# Altium project Brelok_MFU.PrjPcb
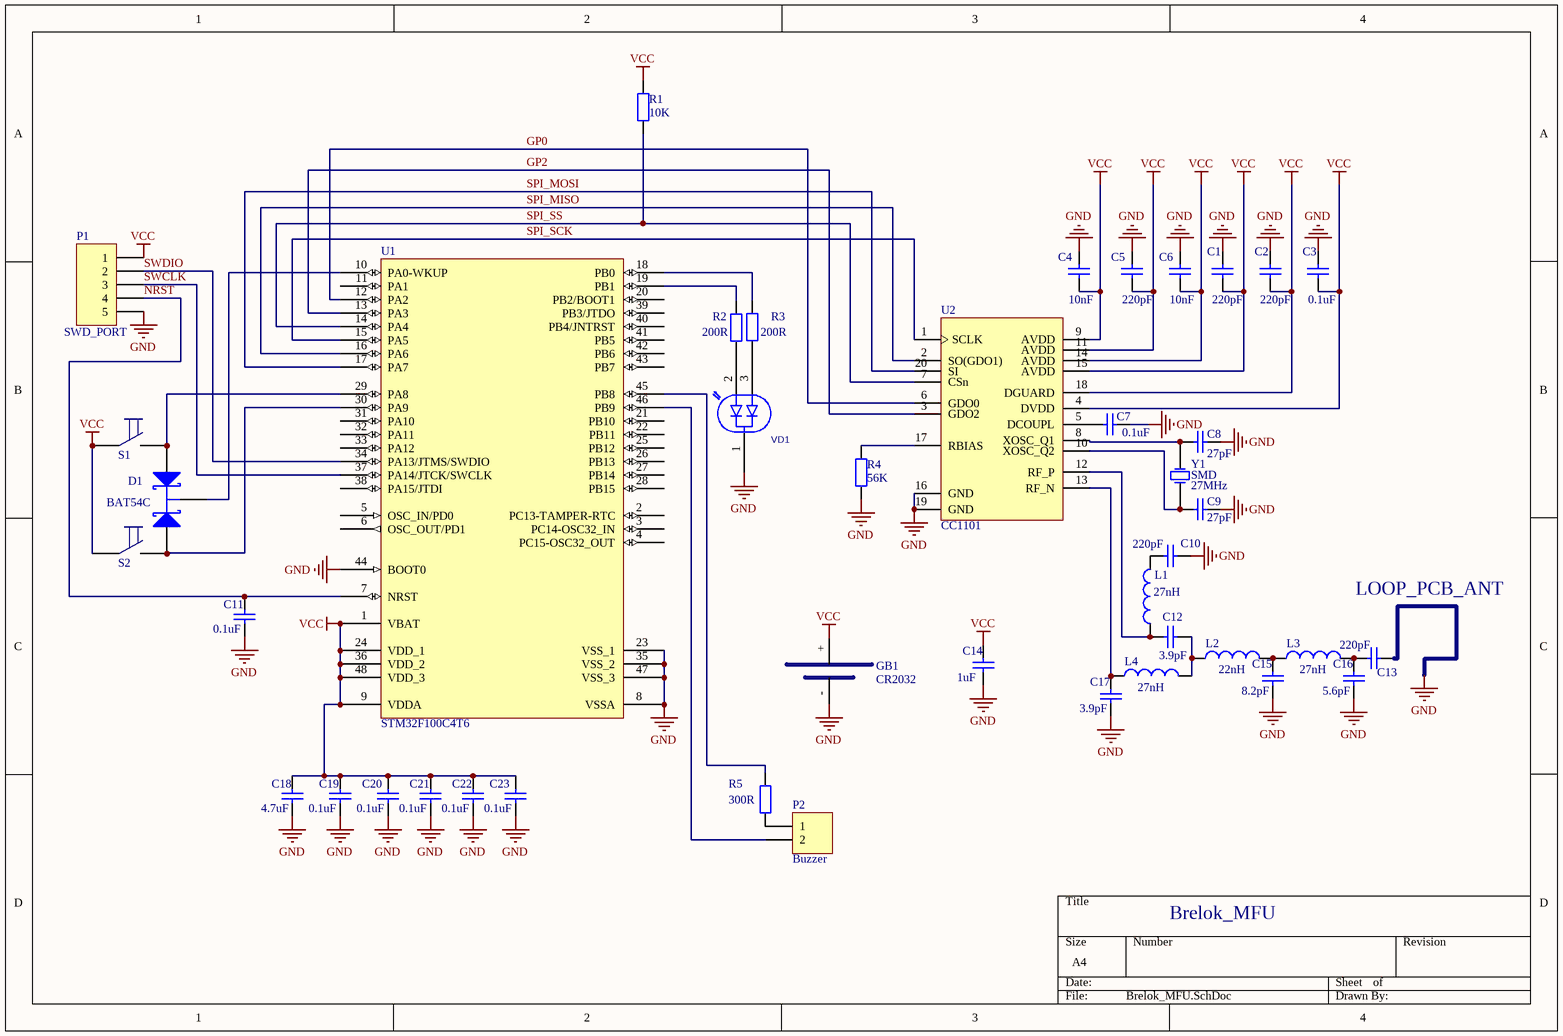
[diagram p0: Brelok_MFU.SchDoc]
1 sheet, 42 parts. Net scope: global (net labels, ports and power ports of the same name join across sheets).
Board file: Brelok_MFU.PcbDoc

## Sheet Brelok_MFU.SchDoc
size A4; Author: Gordeychik Alexandr; CompanyName: NTS; CurrentDate: 20.06.2013

### Parts
C1  value 220pF  [C0603]  (hidden comment: 0805)
C2  value 220pF  [C0603]  (hidden comment: 0805)
C3  value 0.1uF  [C0603]  (hidden comment: 0805)
C4  value 10nF  [C0603]  (hidden comment: 0805)
C5  value 220pF  [C0603]  (hidden comment: 0805)
C6  value 10nF  [C0603]  (hidden comment: 0805)
C7  value 0.1uF  [C0603]  (hidden comment: 0805)
C8  value 27pF  [C0603]  (hidden comment: 0805)
C9  value 27pF  [C0603]  (hidden comment: 0805)
C10  value 220pF  [C0603]  (hidden comment: 0805)
C11  value 0.1uF  [C0603]  (hidden comment: 0805)
C12  value 3.9pF  [C0603]  (hidden comment: 0805)
C13  value 220pF  [C0603]  (hidden comment: 0805)
C14  value 1uF  [C0603]  (hidden comment: 0805)
C15  value 8.2pF  [C0603]  (hidden comment: 0805)
C16  value 5.6pF  [C0603]  (hidden comment: 0805)
C17  value 3.9pF  [C0603]  (hidden comment: 0805)
C18  value 4.7uF  [C0805]  (hidden comment: 0805)
C19  value 0.1uF  [C0603]  (hidden comment: 0805)
C20  value 0.1uF  [C0603]  (hidden comment: 0805)
C21  value 0.1uF  [C0603]  (hidden comment: 0805)
C22  value 0.1uF  [C0603]  (hidden comment: 0805)
C23  value 0.1uF  [C0603]  (hidden comment: 0805)
D1  BAT54C  [SOT23_N]
GB1  CR2032  [BAT_Holder_CR2032]
L1  value 27nH  [L0603]  (hidden comment: SMD)
L2  value 22nH  [L0603]  (hidden comment: SMD)
L3  value 27nH  [L0603]  (hidden comment: SMD)
L4  value 27nH  [L0603]  (hidden comment: SMD)
P1  SWD_PORT  [HDR1X5]
P2  Buzzer  [HDR1X2]
R1  value 10K  [C0603]  (hidden comment: RES)
R2  value 200R  [C0603]  (hidden comment: RES)
R3  value 200R  [C0603]  (hidden comment: RES)
R4  value 56K  [C0603]  (hidden comment: RES)
R5  value 300R  [C0603]  (hidden comment: RES)
S1  KAN0642-0501B  [KAN0642-0501B]  (value not drawn)
S2  KAN0642-0501B  [KAN0642-0501B]  (value not drawn)
U1  STM32F100C4T6  [LQFP48_M]
U2  CC1101  [VQFN20]
VD1  LIGHTDIODE2  [LIGHTDIODE2]  (value not drawn)
Y1  SMD  [Quartz_SMD0603]

### Nets
GND: C1.1 C2.1 C3.1 C4.1 C5.1 C6.1 C7.2 C8.2 C9.2 C10.2 C11.2 C13.2 C14.2 C15.1 C16.1 C17.1 C18.2 C19.2 C20.2 C21.2 C22.2 C23.2 GB1.- P1.5 R4.1 U1.8(VSSA) U1.23(VSS_1) U1.35(VSS_2) U1.44(BOOT0) U1.47(VSS_3) U2.16(GND) U2.19(GND) VD1.1
VCC: C1.2 C2.2 C3.2 C4.2 C5.2 C6.2 C14.1 C18.1 C19.1 C20.1 C21.1 C22.1 C23.1 GB1.+ P1.1 R1.2 S1.1 S2.1 U1.1(VBAT) U1.9(VDDA) U1.24(VDD_1) U1.36(VDD_2) U1.48(VDD_3) U2.4(DVDD) U2.9(AVDD) U2.11(AVDD) U2.14(AVDD) U2.15(AVDD) U2.18(DGUARD)
GP0: U1.12(PA2) U2.6(GDO0)
GP2: U1.13(PA3) U2.3(GDO2)
NRST: C11.1 P1.4 U1.7(NRST)
SPI_MISO: U1.16(PA6) U2.2(SO(GDO1))
SPI_MOSI: U1.17(PA7) U2.20(SI)
SPI_SCK: U1.15(PA5) U2.1(SCLK)
SPI_SS: R1.1 U1.14(PA4) U2.7(CSn)
SWCLK: P1.3 U1.37(PA14/JTCK/SWCLK)
SWDIO: P1.2 U1.34(PA13/JTMS/SWDIO)
NetC7_1: C7.1 U2.5(DCOUPL)
NetC8_1: C8.1 U2.8(XOSC_Q1) Y1.1(OSC1)
NetC9_1: C9.1 U2.10(XOSC_Q2) Y1.3(OSC2)
NetC10_1: C10.1 L1.2
NetC12_1: C12.1 L2.1 L4.2
NetC12_2: C12.2 L1.1 U2.12(RF_P)
NetC13_1: C13.1 C16.2 L3.2
NetC15_2: C15.2 L2.2 L3.1
NetC17_2: C17.2 L4.1 U2.13(RF_N)
NetD1_1: D1.1(A1) S1.2 U1.29(PA8)
NetD1_2: D1.2(A2) S2.2 U1.30(PA9)
NetD1_3: D1.3(K) U1.10(PA0-WKUP)
NetP2_1: P2.1 R5.1
NetP2_2: P2.2 U1.46(PB9)
NetR2_1: R2.1 VD1.2
NetR2_2: R2.2 U1.19(PB1)
NetR3_1: R3.1 VD1.3
NetR3_2: R3.2 U1.18(PB0)
NetR4_2: R4.2 U2.17(RBIAS)
NetR5_2: R5.2 U1.45(PB8)

Not connected (* = marked no-connect by the designer): U1 2(PC13-TAMPER-RTC) 3(PC14-OSC32_IN) 4(PC15-OSC32_OUT) 5(OSC_IN/PD0) 6(OSC_OUT/PD1) 11(PA1) 20(PB2/BOOT1) 21(PB10) 22(PB11) 25(PB12) 26(PB13) 27(PB14) 28(PB15) 31(PA10) 32(PA11) 33(PA12) 38(PA15/JTDI) 39(PB3/JTDO) 40(PB4/JNTRST) 41(PB5) 42(PB6) 43(PB7)

### Notes on the sheet
- LOOP_PCB_ANT
- Brelok_MFU
- (in symbol Quartz_SMD) 27MHz

### Library data of the parts
C1-C23 = Capasitor_SMD_0805: Capasitor_SMD_0808/
D1 = BAT54C: Schottky Barrier Double Diode; Published: 17-Sep-2003; LatestRevisionDate: 12-Dec-2006; LatestRevisionNote: IPC-7351 Footprint Added.; DatasheetVersion: 4-Mar-2002; PackageVersion: May-1999; PackageReference: SOT23; Publisher: Altium Limited; PackageDescription: 3-Pin SOT-23 Package 0.95 mm Pitch, 2.3 mm Lead Span; ComponentLink1Description: Manufacturer Link; ComponentLink1URL: http://www.semiconductors.philips.com/; ComponentLink2Description: Datasheet; ComponentLink2URL: http://www.semiconductors.philips.com/acrobat/datasheets/BAT54_SERIES_4.pdf
GB1 = BAT_Holder_CR2032: BTH-W39-20
L1-L4 = Induktor_SMD
P1 = Header 5: Header, 5-Pin; LatestRevisionDate: 17-Jul-2002; LatestRevisionNote: Re-released for DXP Platform.; Publisher: Altium Limited
P2 = Header 2: Header, 2-Pin; LatestRevisionDate: 17-Jul-2002; LatestRevisionNote: Re-released for DXP Platform.; Publisher: Altium Limited
R1-R5 = RES: Resistor
U1 = STM32F101C6T6: STM32 ARM-based 32-bit MCU with 32 Kbytes Flash, 48-pin LQFP, Industrial Temperature; Published: 30-May-2008; DatasheetVersion: rev6, Mar-2008; PackageVersion: Mar-2008; PackageReference: LQFP48; Publisher: Altium Limited; PackageDescription: 48-Pin Low-Profile Quad Flat Pack, 7 x 7 mm Body, 0.5 mm Pitch (LQFP48); ComponentLink1Description: Manufacturer Link; ComponentLink1URL: www.st.com/stm32; ComponentLink2Description: Datasheet; ComponentLink2URL: http://www.st.com/stonline/products/literature/ds/13586.pdf
Y1 = Quartz_SMD
VD1 = LIGHTDIODE2: Value: *